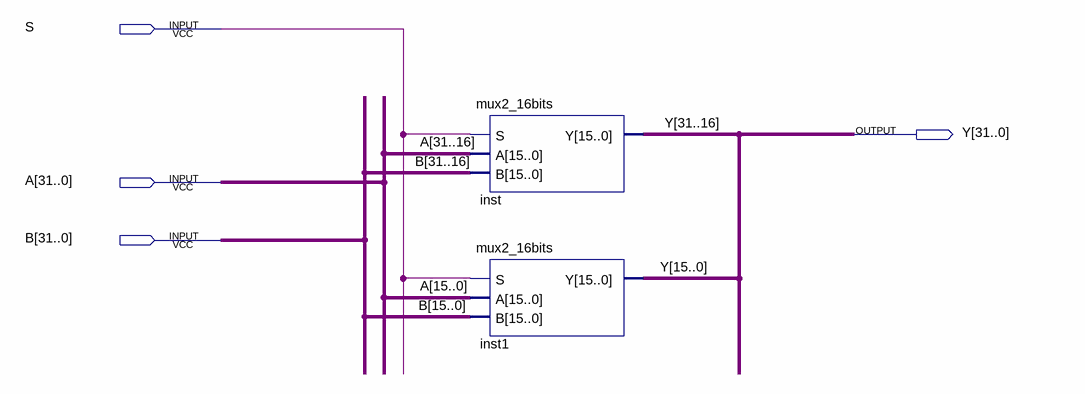
[diagram p0: schematic sheet]
// Quartus schematic mux2_32bits.bdf as structural Verilog: 2 symbols, 4 pins
module mux2_32bits (
  input  S,
  input  [31:0] A,
  input  [31:0] B,
  output [31:0] Y
);

  mux2_16bits inst (.S(S), .A(A[31:16]), .B(B[31:16]), .Y(Y[31:16]));
  mux2_16bits inst1 (.S(S), .A(A[15:0]), .B(B[15:0]), .Y(Y[15:0]));
endmodule
